# Altium schematic sheet 21_STEP_MOTOR_ISOLATOR_INPUT.SchDoc
size 420 x 297 mm; SheetNumber: 21; SheetTotal: 27
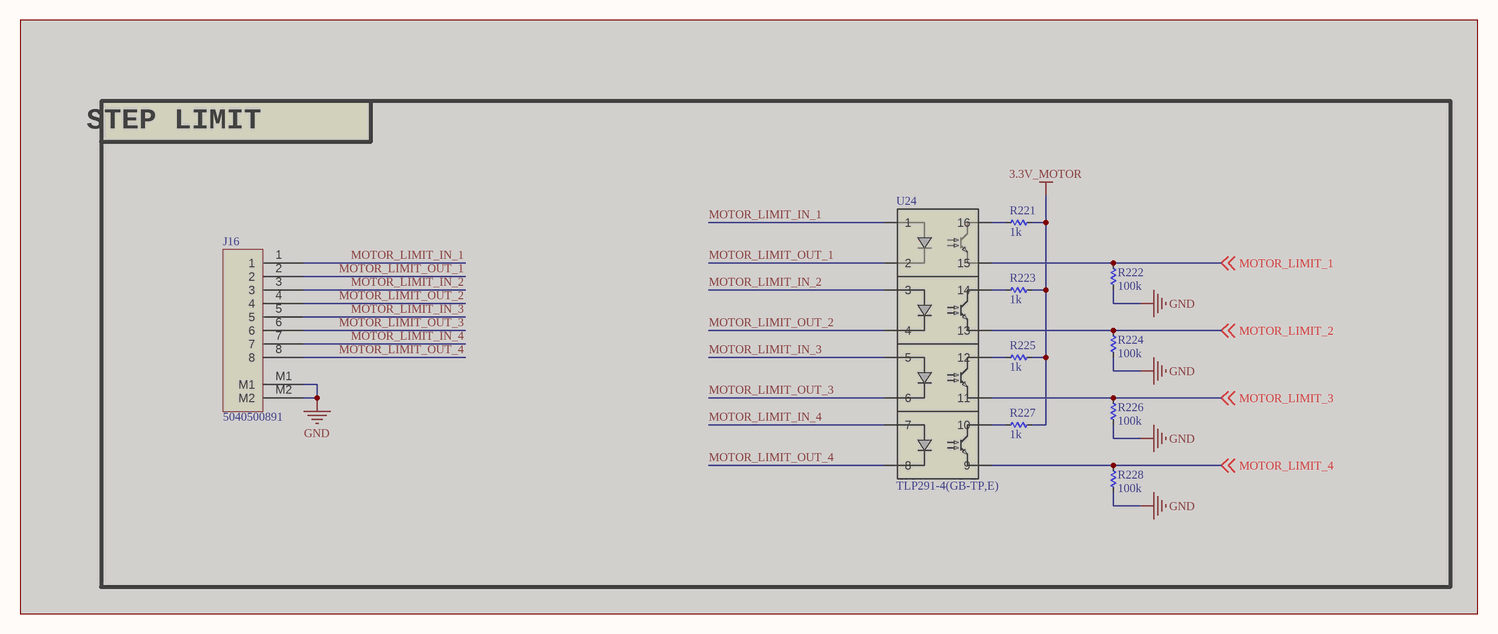
[diagram p0: 21_STEP_MOTOR_ISOLATOR_INPUT.SchDoc]

## Parts
J16  5040500891  [MOLEX_5040500891]  (masked out: inside a compile mask, not in the netlist)
R221  1k  [RES_C_1005X40]  (masked out: inside a compile mask, not in the netlist)
R222  100k  [RES_C_1005X40]  (masked out: inside a compile mask, not in the netlist)
R223  1k  [RES_C_1005X40]  (masked out: inside a compile mask, not in the netlist)
R224  100k  [RES_C_1005X40]  (masked out: inside a compile mask, not in the netlist)
R225  1k  [RES_C_1005X40]  (masked out: inside a compile mask, not in the netlist)
R226  100k  [RES_C_1005X40]  (masked out: inside a compile mask, not in the netlist)
R227  1k  [RES_C_1005X40]  (masked out: inside a compile mask, not in the netlist)
R228  100k  [RES_C_1005X40]  (masked out: inside a compile mask, not in the netlist)
U24  TLP291-4(GB-TP,E)  [SO16_TOS]  (masked out: inside a compile mask, not in the netlist)

## Blocks framed on the sheet
STEP LIMIT: J16 R221-R228 U24

## Notes on the sheet
- Project
- Sub-system:
- Design by:
- Sheet title:
- Sheet:
- of
- Checked by:
- Approved by:
- Doc no:
- Revision
- Size:
- Date:

## Library data of the parts
J16 = Header 8x1_2M
R221-R228 = _RES_B_2: RES
U24 = TLP291-4GB-TP,E: Description; Manufacturer_Name: Toshiba Electronic Devices & Storage Corp.; Source_Package: TLP291_4; Number_devices_in_Package: 1; Copyright: Copyright (C) 2026 Ultra Librarian. All rights reserved.; Manufacturer_Part_Number: TLP291-4(GB-TP,E); RefDes: Refdes; Type: Type